# EAGLE design stereo_mixer_quasi_diff_vertical (EAGLE 6.4)
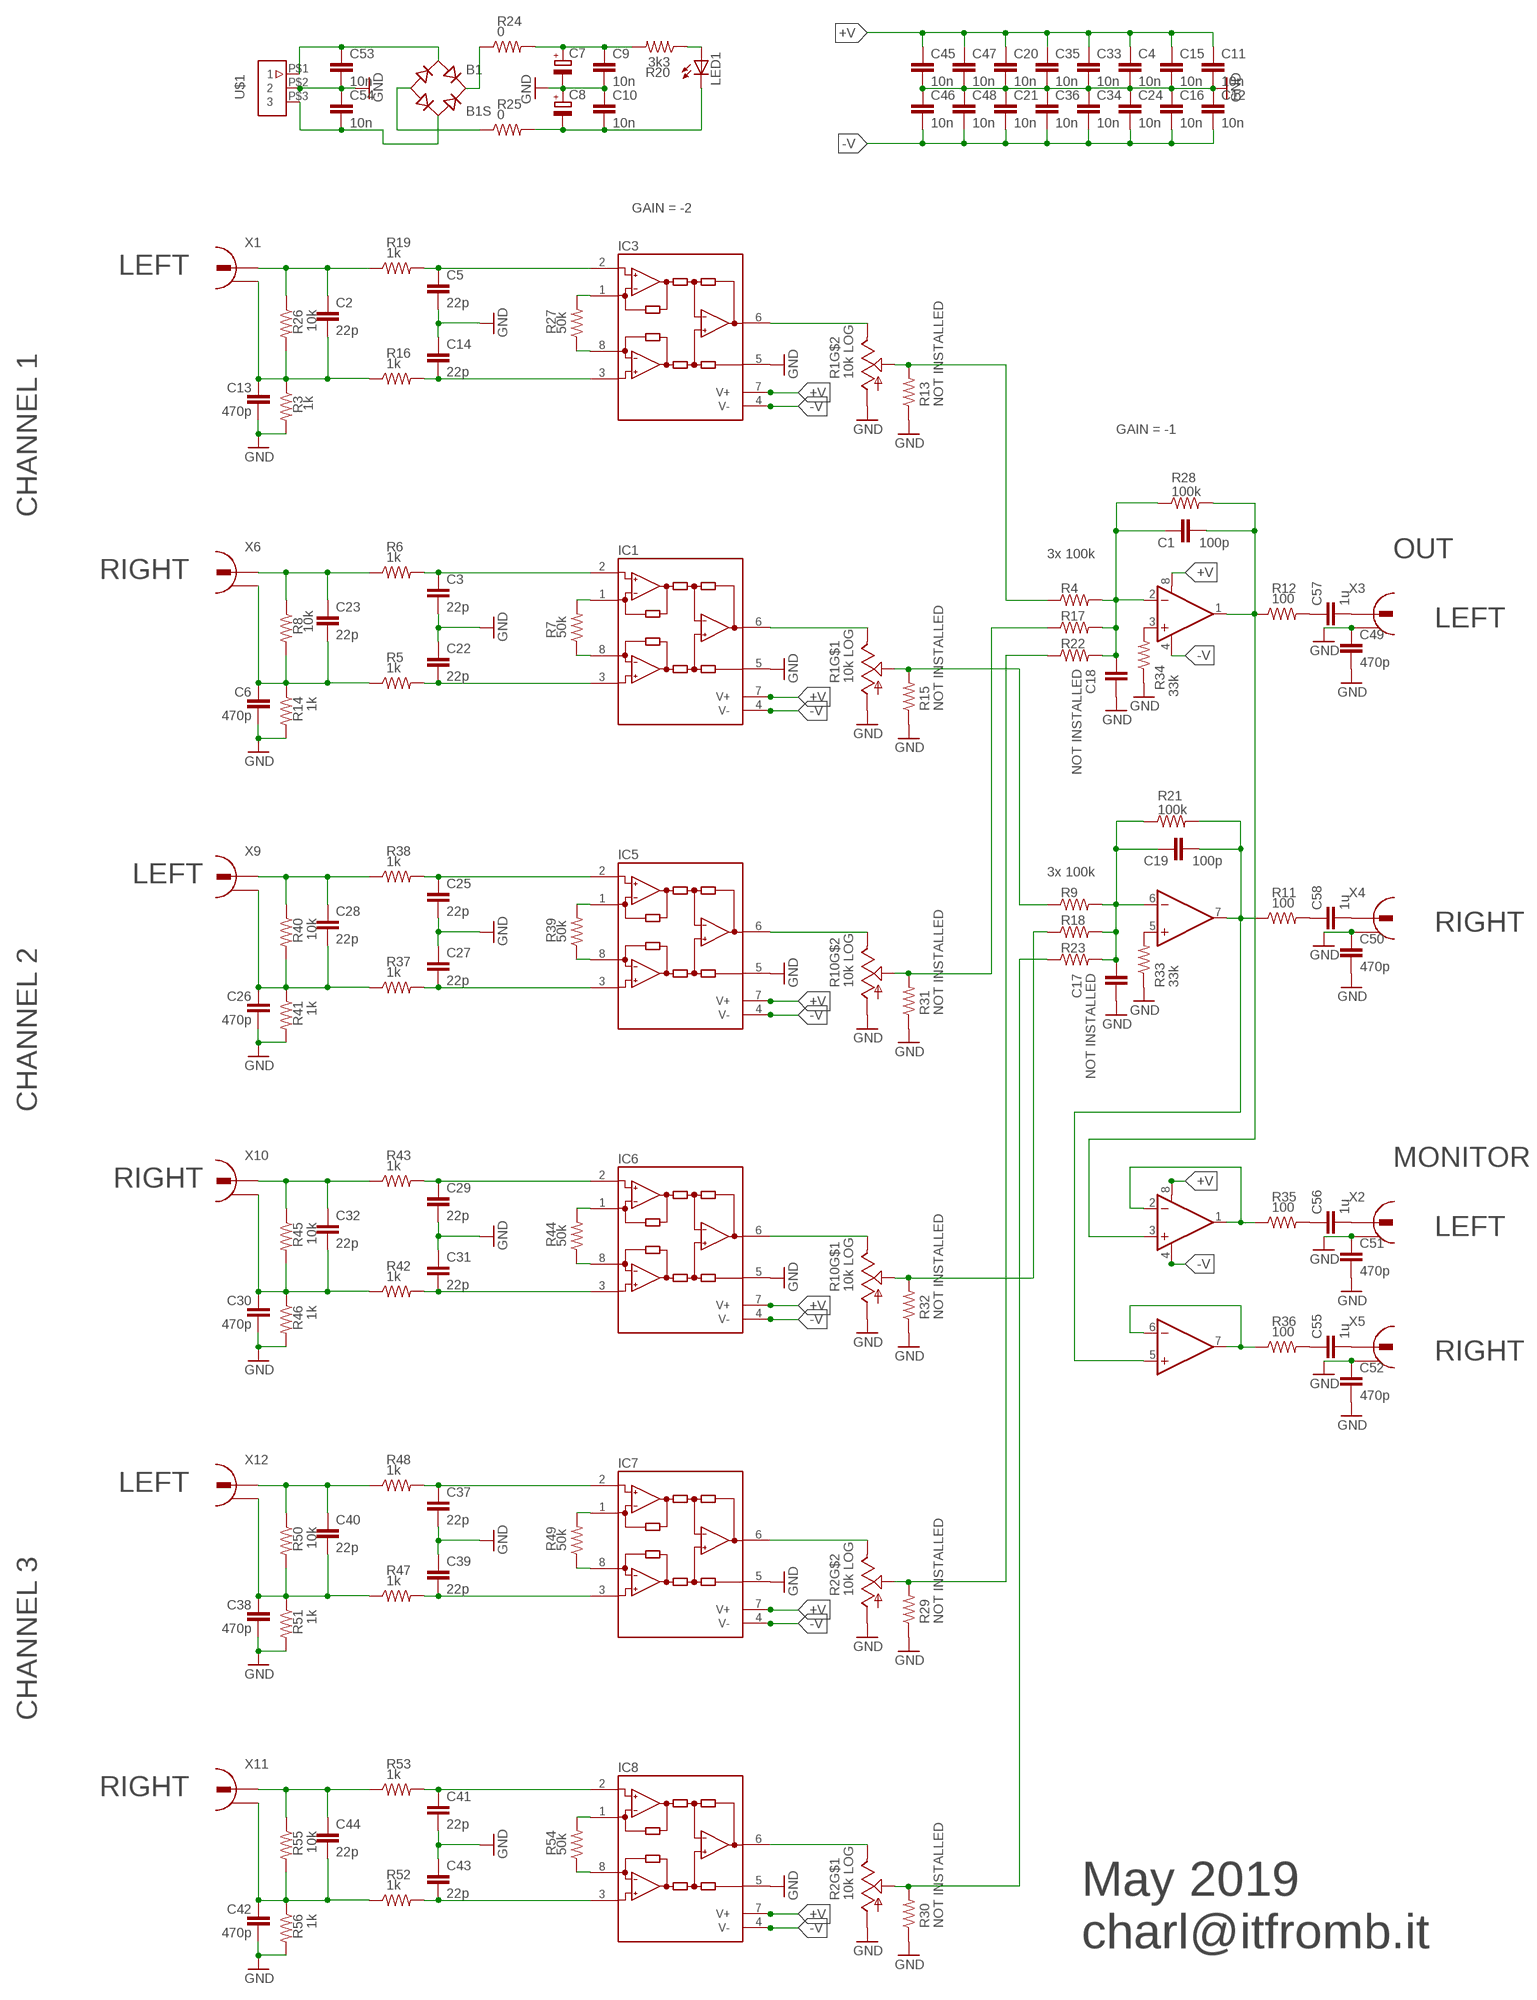
[diagram p0: schematic, sheet 1]

## Parts
B1  B1S  [MBS]
C1  100p  C-EUC1206  [C1206]
C2  22p  C-EUC1206  [C1206]
C3  22p  C-EUC1206  [C1206]
C4  10n  C-EUC1206  [C1206]
C5  22p  C-EUC1206  [C1206]
C6  470p  C-EUC1206  [C1206]
C7  CPOL-EUSANYO_SMD_F12  [SANYO-OSCON_SMD_F12]
C8  CPOL-EUSANYO_SMD_F12  [SANYO-OSCON_SMD_F12]
C9  10n  C-EUC1206  [C1206]
C10  10n  C-EUC1206  [C1206]
C11  10n  C-EUC1206  [C1206]
C12  10n  C-EUC1206  [C1206]
C13  470p  C-EUC1206  [C1206]
C14  22p  C-EUC1206  [C1206]
C15  10n  C-EUC1206  [C1206]
C16  10n  C-EUC1206  [C1206]
C17  NOT INSTALLED  C-EUC1206  [C1206]
C18  NOT INSTALLED  C-EUC1206  [C1206]
C19  100p  C-EUC1206  [C1206]
C20  10n  C-EUC1206  [C1206]
C21  10n  C-EUC1206  [C1206]
C22  22p  C-EUC1206  [C1206]
C23  22p  C-EUC1206  [C1206]
C24  10n  C-EUC1206  [C1206]
C25  22p  C-EUC1206  [C1206]
C26  470p  C-EUC1206  [C1206]
C27  22p  C-EUC1206  [C1206]
C28  22p  C-EUC1206  [C1206]
C29  22p  C-EUC1206  [C1206]
C30  470p  C-EUC1206  [C1206]
C31  22p  C-EUC1206  [C1206]
C32  22p  C-EUC1206  [C1206]
C33  10n  C-EUC1206  [C1206]
C34  10n  C-EUC1206  [C1206]
C35  10n  C-EUC1206  [C1206]
C36  10n  C-EUC1206  [C1206]
C37  22p  C-EUC1206  [C1206]
C38  470p  C-EUC1206  [C1206]
C39  22p  C-EUC1206  [C1206]
C40  22p  C-EUC1206  [C1206]
C41  22p  C-EUC1206  [C1206]
C42  470p  C-EUC1206  [C1206]
C43  22p  C-EUC1206  [C1206]
C44  22p  C-EUC1206  [C1206]
C45  10n  C-EUC1206  [C1206]
C46  10n  C-EUC1206  [C1206]
C47  10n  C-EUC1206  [C1206]
C48  10n  C-EUC1206  [C1206]
C49  470p  C-EUC1206  [C1206]
C50  470p  C-EUC1206  [C1206]
C51  470p  C-EUC1206  [C1206]
C52  470p  C-EUC1206  [C1206]
C53  10n  C-EUC1206  [C1206]
C54  10n  C-EUC1206  [C1206]
C55  1u  C-EUC1206  [C1206]
C56  1u  C-EUC1206  [C1206]
C57  1u  C-EUC1206  [C1206]
C58  1u  C-EUC1206  [C1206]
IC1  INA118U  [SO08]
IC2  OPAMP-DUALU  [SO08]
IC3  INA118U  [SO08]
IC4  OPAMP-DUALU  [SO08]
IC5  INA118U  [SO08]
IC6  INA118U  [SO08]
IC7  INA118U  [SO08]
IC8  INA118U  [SO08]
LED1  LEDCHIPLED_1206  [CHIPLED_1206]
R1  10k LOG  TRIM_US-  [SLIDE_POT_REAR_CONN]
R2  10k LOG  TRIM_US-  [SLIDE_POT_REAR_CONN]
R3  1k  R-US_M1206  [M1206]
R4  100k  R-US_M1206  [M1206]
R5  1k  R-US_M1206  [M1206]
R6  1k  R-US_M1206  [M1206]
R7  50k  R-US_M1206  [M1206]
R8  10k  R-US_M1206  [M1206]
R9  100k  R-US_M1206  [M1206]
R10  10k LOG  TRIM_US-  [SLIDE_POT_REAR_CONN]
R11  100  R-US_M1206  [M1206]
R12  100  R-US_M1206  [M1206]
R13  NOT INSTALLED  R-US_M1206  [M1206]
R14  1k  R-US_M1206  [M1206]
R15  NOT INSTALLED  R-US_M1206  [M1206]
R16  1k  R-US_M1206  [M1206]
R17  100k  R-US_M1206  [M1206]
R18  100k  R-US_M1206  [M1206]
R19  1k  R-US_M1206  [M1206]
R20  3k3  R-US_M1206  [M1206]
R21  100k  R-US_M1206  [M1206]
R22  100k  R-US_M1206  [M1206]
R23  100k  R-US_M1206  [M1206]
R24  0  R-US_M1206  [M1206]
R25  0  R-US_M1206  [M1206]
R26  10k  R-US_M1206  [M1206]
R27  50k  R-US_M1206  [M1206]
R28  100k  R-US_M1206  [M1206]
R29  NOT INSTALLED  R-US_M1206  [M1206]
R30  NOT INSTALLED  R-US_M1206  [M1206]
R31  NOT INSTALLED  R-US_M1206  [M1206]
R32  NOT INSTALLED  R-US_M1206  [M1206]
R33  33k  R-US_M1206  [M1206]
R34  33k  R-US_M1206  [M1206]
R35  100  R-US_M1206  [M1206]
R36  100  R-US_M1206  [M1206]
R37  1k  R-US_M1206  [M1206]
R38  1k  R-US_M1206  [M1206]
R39  50k  R-US_M1206  [M1206]
R40  10k  R-US_M1206  [M1206]
R41  1k  R-US_M1206  [M1206]
R42  1k  R-US_M1206  [M1206]
R43  1k  R-US_M1206  [M1206]
R44  50k  R-US_M1206  [M1206]
R45  10k  R-US_M1206  [M1206]
R46  1k  R-US_M1206  [M1206]
R47  1k  R-US_M1206  [M1206]
R48  1k  R-US_M1206  [M1206]
R49  50k  R-US_M1206  [M1206]
R50  10k  R-US_M1206  [M1206]
R51  1k  R-US_M1206  [M1206]
R52  1k  R-US_M1206  [M1206]
R53  1k  R-US_M1206  [M1206]
R54  50k  R-US_M1206  [M1206]
R55  10k  R-US_M1206  [M1206]
R56  1k  R-US_M1206  [M1206]
U$1  3-PIN-JST-CONN-1.25MM-PITCH  [S3B-PH-VERTICAL]
X1  736880-49RCA-REAR-MOUNT  [RCA-REAR-MOUNT]
X2  736880-49  [RCA-REAR-MOUNT-CENTER-ONLY]
X3  736880-49  [RCA-REAR-MOUNT-CENTER-ONLY]
X4  736880-49  [RCA-REAR-MOUNT-CENTER-ONLY]
X5  736880-49  [RCA-REAR-MOUNT-CENTER-ONLY]
X6  736880-49RCA-REAR-MOUNT  [RCA-REAR-MOUNT]
X9  736880-49RCA-REAR-MOUNT  [RCA-REAR-MOUNT]
X10  736880-49RCA-REAR-MOUNT  [RCA-REAR-MOUNT]
X11  736880-49RCA-REAR-MOUNT  [RCA-REAR-MOUNT]
X12  736880-49RCA-REAR-MOUNT  [RCA-REAR-MOUNT]

## Nets
+V: C4.1 C7.+ C9.1 C11.1 C15.1 C20.1 C33.1 C35.1 C45.1 C47.1 IC1.7(V+) IC2.8(A:V+) IC3.7(V+) IC4.8(A:V+) IC5.7(V+) IC6.7(V+) IC7.7(V+) IC8.7(V+) R20.2 R24.2
-V: C8.- C10.2 C12.2 C16.2 C21.2 C24.2 C34.2 C36.2 C46.2 C48.2 IC1.4(V-) IC2.4(A:V-) IC3.4(V-) IC4.4(A:V-) IC5.4(V-) IC6.4(V-) IC7.4(V-) IC8.4(V-) LED1.C R25.2
GND: C3.2 C4.2 C5.2 C6.2 C7.- C8.+ C9.2 C10.1 C11.2 C12.1 C13.2 C14.1 C15.2 C16.1 C17.1 C18.1 C20.2 C21.1 C22.1 C24.1 C25.2 C26.2 C27.1 C29.2 C30.2 C31.1 C33.2 C34.1 C35.2 C36.1 C37.2 C38.2 C39.1 C41.2 C42.2 C43.1 C45.2 C46.1 C47.2 C48.1 C49.1 C49.2 C50.1 C50.2 C51.1 C51.2 C52.1 C52.2 C53.2 C54.1 IC1.5(REF) IC3.5(REF) IC5.5(REF) IC6.5(REF) IC7.5(REF) IC8.5(REF) R1.R1A(RA) R1.R2A(RA) R2.R1A(RA) R2.R2A(RA) R3.2 R10.R1A(RA) R10.R2A(RA) R13.1 R14.2 R15.1 R29.1 R30.1 R31.1 R32.1 R33.1 R34.1 R41.2 R46.2 R51.2 R56.2 U$1.P$2 X2.SIGNAL X3.SIGNAL X4.SIGNAL X5.SIGNAL
N$2: IC4.1(A:OUT) IC4.2(A:-IN) R35.1
N$3: C2.1 R19.1 R26.1 X1.SIGNAL
N$4: C37.1 IC7.2(-IN) R48.2
N$5: IC3.6(OUT) R1.R2B(RB)
N$6: IC2.5(B:+IN) R33.2
N$7: R1.R2W(RW) R4.1 R13.2
N$8: C38.1 C40.2 R47.1 R50.2 R51.1 X12.RING
N$10: R1.R1W(RW) R9.1 R15.2
N$11: C19.2 IC2.7(B:OUT) IC4.5(B:+IN) R11.1 R21.2
N$12: IC3.1(RG) R27.2
N$13: C3.1 IC1.2(-IN) R6.2
N$14: C25.1 IC5.2(-IN) R38.2
N$16: C6.1 C23.2 R5.1 R8.2 R14.1 X6.RING
N$17: C14.2 IC3.3(+IN) R16.2
N$18: C5.1 IC3.2(-IN) R19.2
N$19: C2.2 C13.1 R3.1 R16.1 R26.2 X1.RING
N$20: IC2.3(A:+IN) R34.2
N$21: C1.1 C18.2 IC2.2(A:-IN) R4.2 R17.2 R22.2 R28.1
N$23: C17.2 C19.1 IC2.6(B:-IN) R9.2 R18.2 R21.1 R23.2
N$24: C23.1 R6.1 R8.1 X6.SIGNAL
N$25: IC1.8(RG) R7.1
N$26: IC3.8(RG) R27.1
N$27: C22.2 IC1.3(+IN) R5.2
N$28: IC1.6(OUT) R1.R1B(RB)
N$29: R2.R2W(RW) R22.1 R29.2
N$30: R2.R1W(RW) R23.1 R30.2
N$31: IC1.1(RG) R7.2
N$32: B1.AC1 C53.1 U$1.P$1
N$33: B1.+ R24.1
N$34: B1.AC2 C54.2 U$1.P$3
N$35: B1.- R25.1
N$36: IC4.6(B:-IN) IC4.7(B:OUT) R36.1
N$38: LED1.A R20.1
N$39: C40.1 R48.1 R50.1 X12.SIGNAL
N$40: C1.2 IC2.1(A:OUT) IC4.3(A:+IN) R12.1 R28.2
N$41: C26.1 C28.2 R37.1 R40.2 R41.1 X9.RING
N$42: C28.1 R38.1 R40.1 X9.SIGNAL
N$43: IC5.8(RG) R39.1
N$44: C27.2 IC5.3(+IN) R37.2
N$45: IC6.6(OUT) R10.R1B(RB)
N$46: IC5.1(RG) R39.2
N$47: C29.1 IC6.2(-IN) R43.2
N$48: C30.1 C32.2 R42.1 R45.2 R46.1 X10.RING
N$49: C32.1 R43.1 R45.1 X10.SIGNAL
N$50: IC6.8(RG) R44.1
N$51: C31.2 IC6.3(+IN) R42.2
N$52: IC5.6(OUT) R10.R2B(RB)
N$53: IC6.1(RG) R44.2
N$54: R10.R2W(RW) R17.1 R31.2
N$55: R10.R1W(RW) R18.1 R32.2
N$57: IC7.8(RG) R49.1
N$58: C39.2 IC7.3(+IN) R47.2
N$59: IC7.1(RG) R49.2
N$60: C41.1 IC8.2(-IN) R53.2
N$61: C42.1 C44.2 R52.1 R55.2 R56.1 X11.RING
N$62: C44.1 R53.1 R55.1 X11.SIGNAL
N$63: IC8.8(RG) R54.1
N$64: C43.2 IC8.3(+IN) R52.2
N$65: IC8.1(RG) R54.2
N$66: IC8.6(OUT) R2.R1B(RB)
N$67: IC7.6(OUT) R2.R2B(RB)
N$69: C55.1 R36.2
N$70: C56.1 R35.2
N$71: C57.1 R12.2
N$72: C58.1 R11.2
N$73: C57.2 X3.RING
N$74: C58.2 X4.RING
N$75: C56.2 X2.RING
N$76: C55.2 X5.RING

## Notes on the sheet
- GAIN = -2
- LEFT
- GAIN = -1
- CHANNEL 1
- RIGHT | 3x 100k | OUT
- LEFT
- LEFT
- 3x 100k
- RIGHT
- CHANNEL 2
- RIGHT | MONITOR
- LEFT
- RIGHT
- LEFT
- CHANNEL 3
- RIGHT
- May 2019
  charl@itfromb.it

## Library data of the parts
B1 = rectifier:B*S: Surface Mount Glass Passivated Bridge Rectifiers Source: Comchip Bridge Rectifiers B05S-G_B10S-G.pdf
C1-C6 C9-C58 = rcl:C-EU: CAPACITOR, European symbol
C7 C8 = stereo_5.1_mixer:CPOL-EU: POLARIZED CAPACITOR, European symbol
IC1 IC3 IC5-IC8 = stereo_5.1_mixer:INA118: Instrumentation Amplifier Precision, Low Power; MF: TEXAS INSTRUMENTS; MPN: INA118U; OC_FARNELL: 1212404; OC_NEWARK: 04M6168
IC2 IC4 = SparkFun:OPAMP-DUAL: Operational Amplifier
LED1 = led:LED: LED OSRAM: - CHIPLED LG R971, LG N971, LY N971, LG Q971, LY Q971, LO R971, LY R971 LH N974, LH R974 LS Q976, LO Q976, LY Q976 LO Q996 - Hyper CHIPLED LW Q18S LB Q993, LB Q99A, LB R99A - SideLED LS A670, LO A670, LY A670, LG A670, LP A670 LB A673, LV A673, LT A673, LW A673 LH A674 LY A675 LS A676, LA A676, LO A676, LY A676, LW A676 LS A679, LY A679, LG A679 - Hyper Micro SIDELED® LS Y876, LA Y876, LO Y876, LY Y876 LT Y87S - SmartLED LW L88C, LW L88S LB L89C, LB L89S, LG L890 LS L89K, LO L89K, LY L89K LS L896, LA L896, LO L896, LY L896 - TOPLED LS T670, LO T670, LY T670, LG T670, LP T670 LSG T670, LSP T670, LSY T670, LOP T670, LYG T670 LG T671, LOG T671, LSG T671 LB T673, LV T673, LT T673, LW T673 LH T674 LS T676, LA T676, LO T676, LY T676, LB T676, LH T676, LSB T676, LW T676 LB T67C, LV T67C, LT T67C, LS T67K, LO T67K, LY T67K, LW E67C LS E67B, LA E67B, LO E67B, LY E67B, LB E67C, LV E67C, LT E67C LW T67C LS T679, LY T679, LG T679 LS T770, LO T770, LY T770, LG T770, LP T770 LB T773, LV T773, LT T773, LW T773 LH T774 LS E675, LA E675, LY E675, LS T675 LS T776, LA T776, LO T776, LY T776, LB T776 LHGB T686 LT T68C, LB T68C - Hyper Mini TOPLED® LB M676 - Mini TOPLED Santana® LG M470 LS M47K, LO M47K, LY M47K Source: http://www.osram.convergy.de LUXEON: - LUMILED® LXK2-PW12-R00, LXK2-PW12-S00, LXK2-PW14-U00, LXK2-PW14-V00 LXK2-PM12-R00, LXK2-PM12-S00, LXK2-PM14-U00 LXK2-PE12-Q00, LXK2-PE12-R00, LXK2-PE12-S00, LXK2-PE14-T00, LXK2-PE14-U00 LXK2-PB12-K00, LXK2-PB12-L00, LXK2-PB12-M00, LXK2-PB14-N00, LXK2-PB14-P00, LXK2-PB14-Q00 LXK2-PR12-L00, LXK2-PR12-M00, LXK2-PR14-Q00, LXK2-PR14-R00 LXK2-PD12-Q00, LXK2-PD12-R00, LXK2-PD12-S00 LXK2-PH12-R00, LXK2-PH12-S00 LXK2-PL12-P00, LXK2-PL12-Q00, LXK2-PL12-R00 Source: www.luxeon.com KINGBRIGHT: KA-3528ASYC Source: www.kingbright.com
R1 R2 R10 = stereo_5.1_mixer:TRIM_US-: POTENTIOMETER
R3-R9 R11-R56 = rcl:R-US_: RESISTOR, American symbol
U$1 = stereo_5.1_mixer:3-PIN-JST-CONN-1.25MM-PITCH
X1-X6 X9-X12 = stereo_5.1_mixer:736880-49: Cinch Connector ( RCA Jack )

## Board
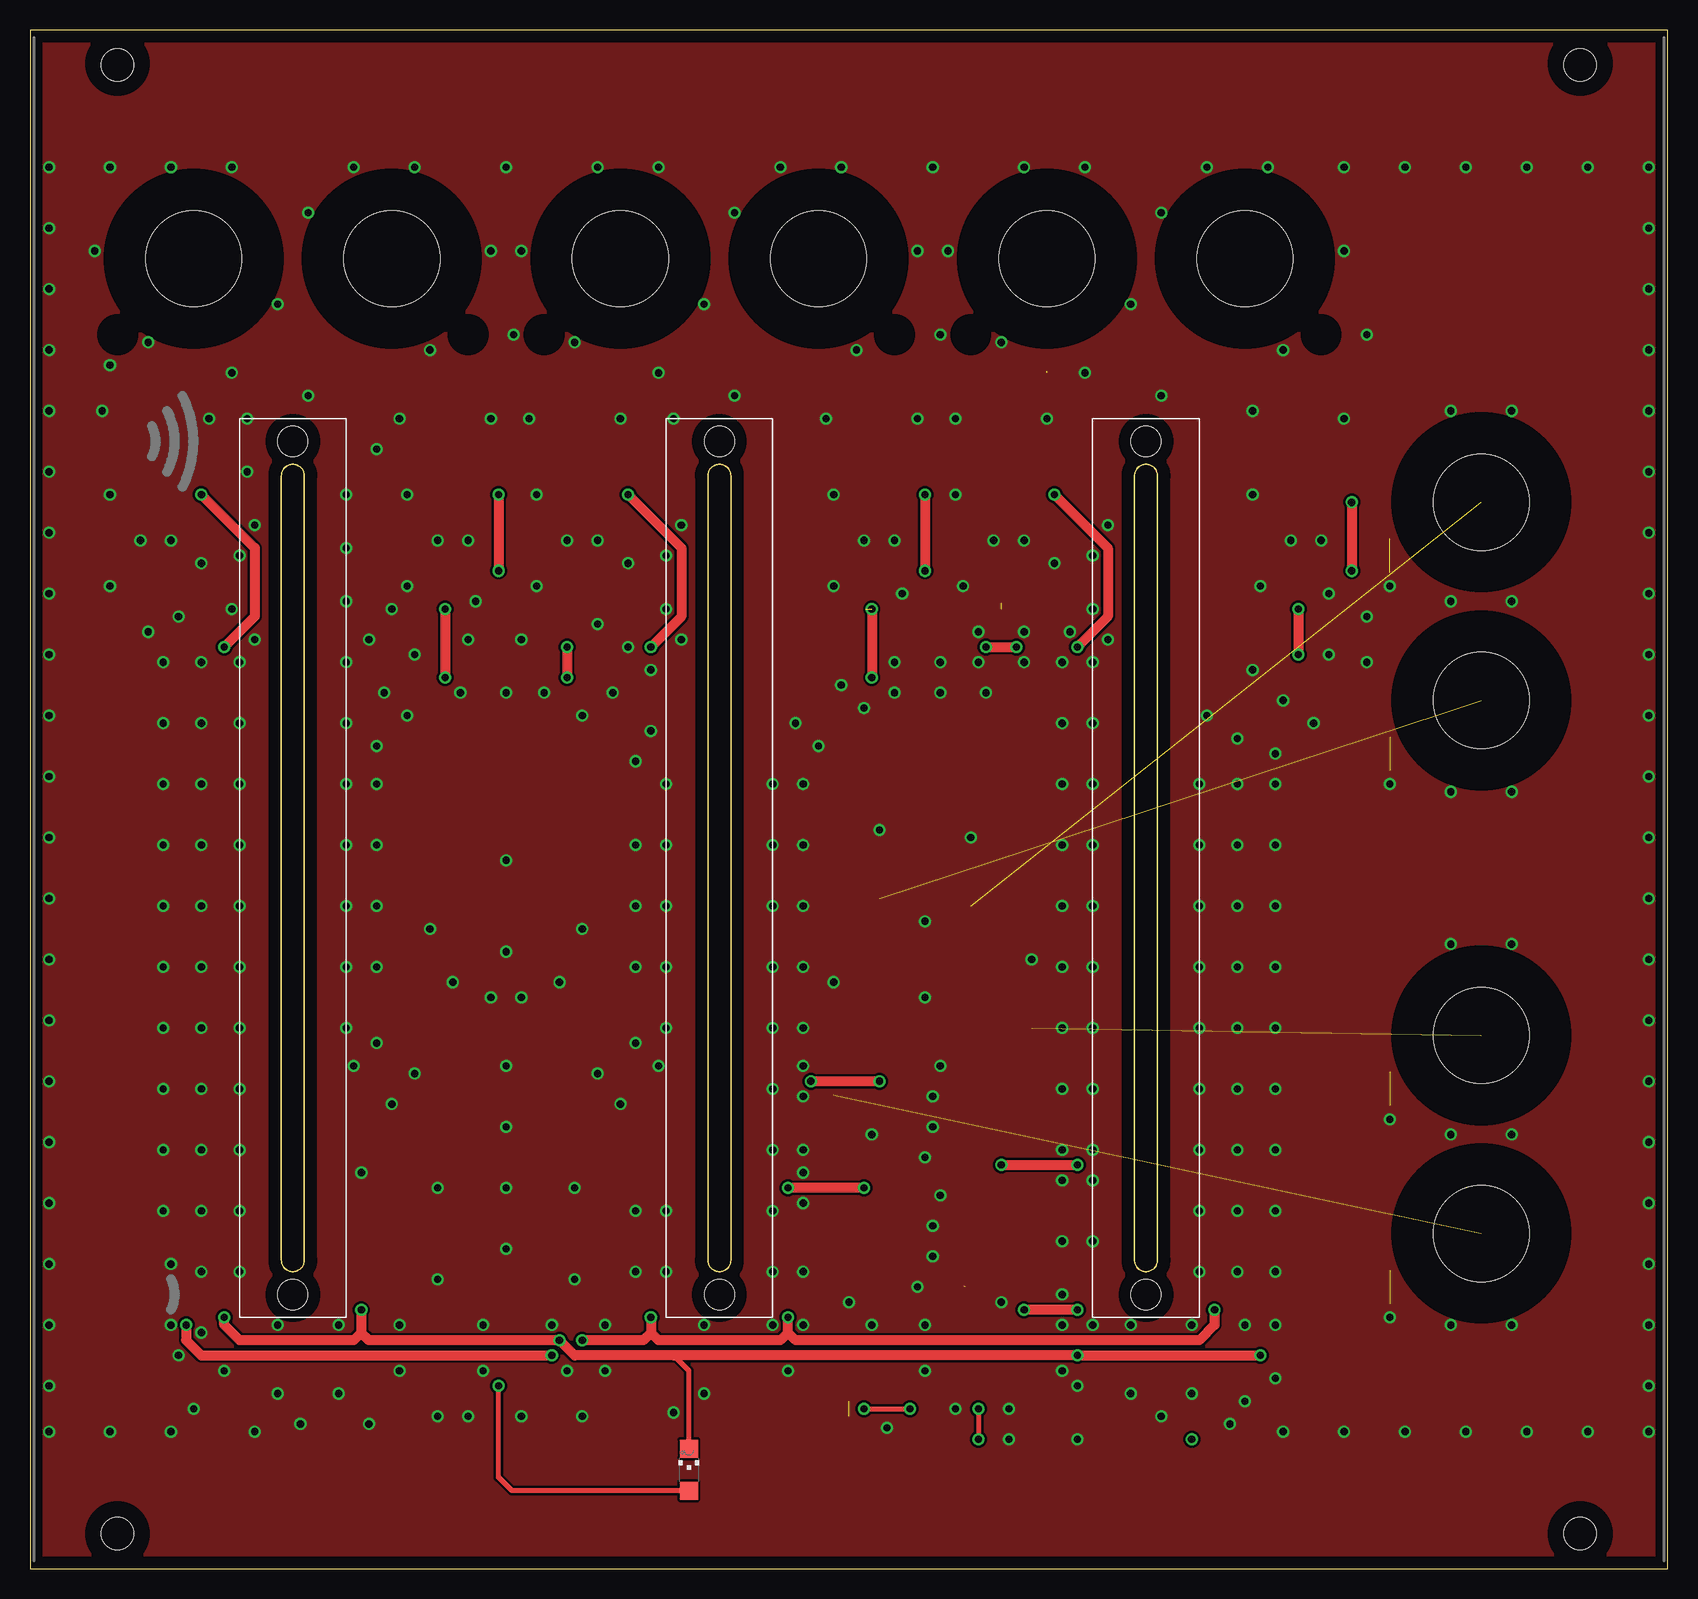
[diagram p1: board, top side]
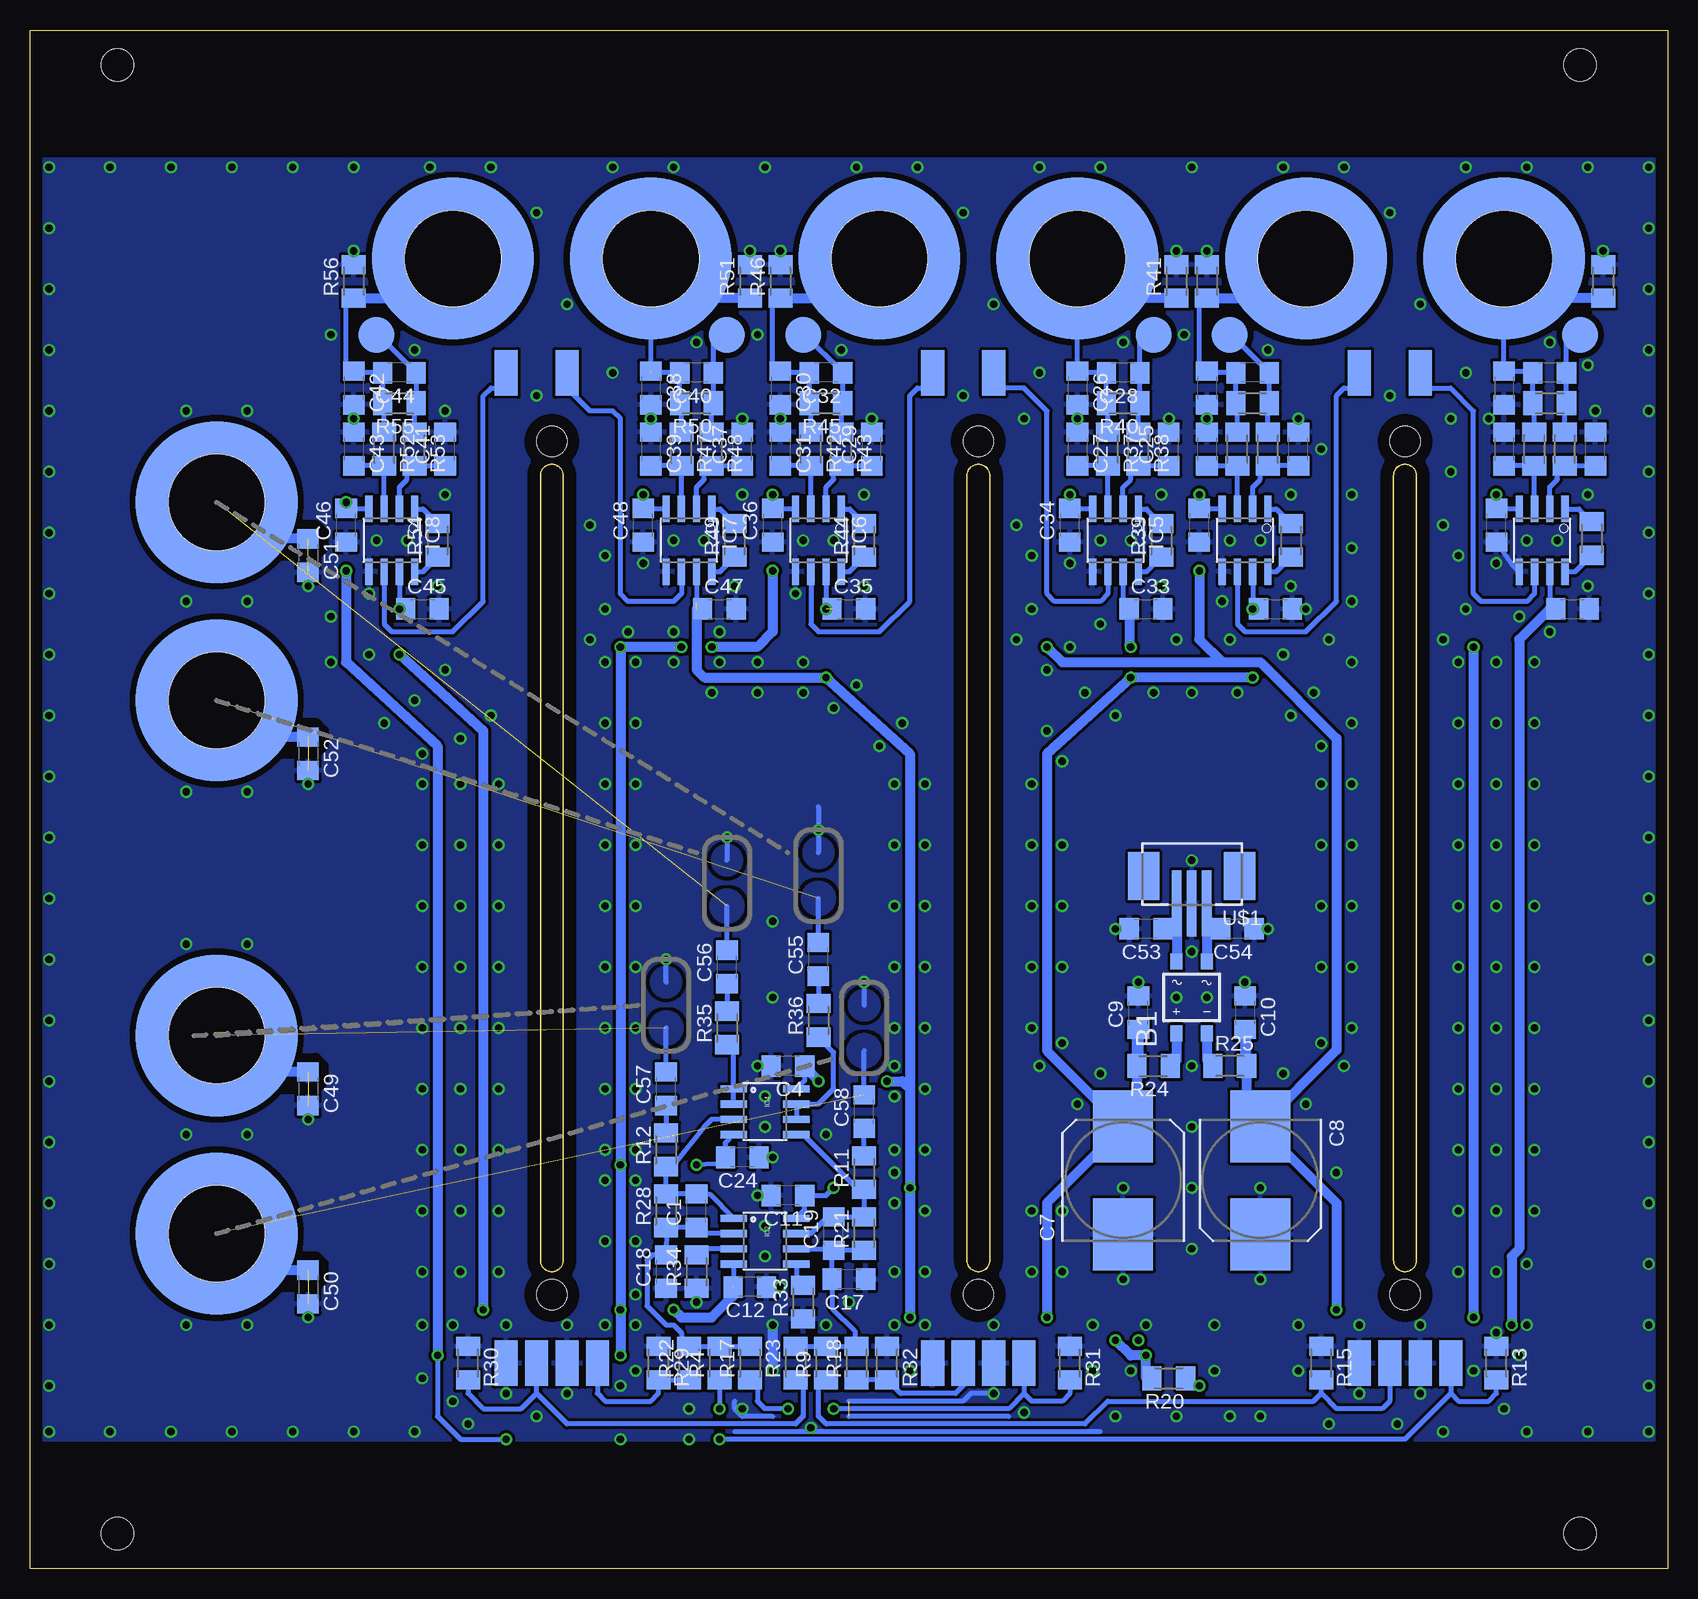
[diagram p2: board, bottom side, seen from below]

Size 136.53 x 128.27 mm. Coordinates in mm from the lower left corner, seen from the top.
Outline: 0,0 136.53,0 136.53,128.27 0,128.27 0,0
Copper layers (1*16): Top 0.035mm / dielectric 1.5mm / Bottom 0.035mm
Design rules "default": minimum track width 10mil, minimum drill 24mil, track to track 8mil, track to pad 8mil, pad to pad 8mil, via to via 8mil, smd to smd 8mil, copper to edge 40mil, drill to drill 8mil, minimum pad ring 10mil, minimum via ring 8mil, stop-mask expansion 4mil, vias tented up to drill 0mil, thermal gap 10mil
Holes 2.7 mm at 129.22,125.35 7.3,125.35 7.3,2.92 129.22,2.92
bKeepout: area 65.7,41.9 to 68.3,44.5; area 65.7,45.7 to 68.3,48.3; area 82.2,43.8 to 84.8,46.4; area 82.2,47.6 to 84.8,50.2; area 77.2,54 to 79.7,56.5; area 77.2,57.8 to 79.7,60.3; area 69.5,58.4 to 72.1,61; area 69.5,54.6 to 72.1,57.2
tRestrict: area 5,0.6 to 9.6,5.2; area 126.9,0.6 to 131.5,5.2; area 126.9,123.2 to 131.5,127.8; area 5,123.2 to 9.6,127.8
bRestrict: area 69.4,58.3 to 72.2,61.1; area 65.6,45.6 to 68.4,48.4; area 82.1,47.5 to 84.9,50.3; area 77,57.7 to 79.8,60.5; 20 lines

### Footprints (pad centres in the part's own frame; a part is rotated, then mirrored left to right if it is on the bottom)
MBS = smd 1 x 1.3: + -1.27,-3; - 1.27,-3; AC1 -1.27,3; AC2 1.27,3
C1206 = smd 1.6 x 1.8: 1 -1.4,0; 2 1.4,0
SANYO-OSCON_SMD_F12 = smd 6 x 5: + 4.5,0; - -4.5,0
SO08 = smd 0.61 x 2.21: 1 -1.905,-2.616; 2 -0.635,-2.616; 3 0.635,-2.616; 4 1.905,-2.616; 5 1.905,2.616; 6 0.635,2.616; 7 -0.635,2.616; 8 -1.905,2.616
CHIPLED_1206 = smd 1.5 x 1.5: A 0,-1.75; C 0,1.75
SLIDE_POT_REAR_CONN = smd 1.93 x 3.81 bottom: R1A -10.16,83.185; R1B -10.16,0.635; R1W -7.62,83.185; R2A -5.08,83.185; R2B -5.08,0.635; R2W -2.54,83.185 | hole 2.5: -6.35,6.35; -6.35,77.47
M1206 = smd 1.6 x 2: 1 -1.4,0; 2 1.4,0
S3B-PH-VERTICAL = smd 0.8 x 5.5: P$1 -1.25,-2; P$2 0,-2; P$3 1.25,-2 | smd 2.6 x 4: P$4 -4,0.27; P$5 4,0.27
RCA-REAR-MOUNT = smd 13.5 x 13.5 bottom: RING 0,0 | smd 3 x 3 bottom: SIGNAL 6.35,6.35 | hole 8: 0,0
RCA-REAR-MOUNT-CENTER-ONLY = smd 13.5 x 13.5 bottom: RING 0,0 | smd 3.226 x 3.226 bottom: SIGNAL 0,0 | hole 8: 0,0

### Placement (x,y rotation side)
B1  39.69,47.62 0 bottom
C1  80.96,29.85 90 bottom
C2  9.84,99.7 180 bottom
C3  30.8,93.34 90 bottom
C4  73.34,41.91 180 bottom
C5  6.03,93.34 90 bottom
C6  38.42,98.43 270 bottom
C7  45.4,32.39 90 bottom
C8  33.97,32.39 270 bottom
C9  44.13,46.36 90 bottom
C10  35.24,46.36 270 bottom
C11  73.34,31.12 180 bottom
C12  76.52,23.5 180 bottom
C13  13.65,98.43 270 bottom
C14  13.65,93.34 270 bottom
C15  7.94,80.01 0 bottom
C16  14.29,87 90 bottom
C17  68.26,24.13 180 bottom
C18  83.5,24.77 90 bottom
C19  69.53,27.94 90 bottom
C20  32.7,80.01 0 bottom
C21  39.05,87 90 bottom
C22  38.42,93.34 270 bottom
C23  34.61,99.7 180 bottom
C24  77.15,34.29 180 bottom
C25  41.59,93.34 90 bottom
C26  49.21,98.43 270 bottom
C27  49.21,93.34 270 bottom
C28  45.4,99.7 180 bottom
C29  66.36,93.34 90 bottom
C30  73.98,98.43 270 bottom
C31  73.98,93.34 270 bottom
C32  70.17,99.7 180 bottom
C33  43.5,80.01 0 bottom
C34  49.85,87 90 bottom
C35  68.26,80.01 0 bottom
C36  74.61,87 90 bottom
C37  77.15,93.34 90 bottom
C38  84.77,98.43 270 bottom
C39  84.77,93.34 270 bottom
C40  80.96,99.7 180 bottom
C41  101.92,93.34 90 bottom
C42  109.54,98.43 270 bottom
C43  109.54,93.34 270 bottom
C44  105.73,99.7 180 bottom
C45  103.82,80.01 0 bottom
C46  110.17,87 90 bottom
C47  79.06,80.01 0 bottom
C48  85.41,87 90 bottom
C49  113.35,40.01 270 bottom
C50  113.35,23.5 270 bottom
C51  113.35,84.46 270 bottom
C52  113.35,67.95 270 bottom
C53  43.5,53.34 180 bottom
C54  35.88,53.34 180 bottom
C55  70.8,50.8 90 bottom
C56  78.42,50.17 90 bottom
C57  83.5,40.01 90 bottom
C58  66.99,38.1 90 bottom
IC1  35.24,85.73 180 bottom
IC2  75.25,27.31 270 bottom
IC3  10.48,85.73 180 bottom
IC4  75.25,38.1 270 bottom
IC5  46.04,85.73 180 bottom
IC6  70.8,85.73 180 bottom
IC7  81.6,85.73 180 bottom
IC8  106.36,85.73 180 bottom
LED1  54.93,8.26 0 top
R1  15.56,100.33 180 top
R2  86.68,100.33 180 top
R3  5.4,107.31 90 bottom
R4  79.06,17.15 90 bottom
R5  35.88,93.34 270 bottom
R6  33.34,93.34 270 bottom
R7  31.43,85.73 90 bottom
R8  34.61,97.16 180 bottom
R9  70.17,17.15 90 bottom
R10  51.12,100.33 180 top
R11  66.99,33.02 90 bottom
R12  83.5,34.93 90 bottom
R13  14.29,17.15 270 bottom
R14  38.42,107.31 90 bottom
R15  28.89,17.15 270 bottom
R16  11.11,93.34 270 bottom
R17  76.52,17.15 90 bottom
R18  67.63,17.15 90 bottom
R19  8.57,93.34 270 bottom
R20  41.59,15.88 180 bottom
R21  66.99,27.94 90 bottom
R22  81.6,17.15 90 bottom
R23  72.71,17.15 90 bottom
R24  42.86,41.91 180 bottom
R25  36.51,41.91 0 bottom
R26  9.84,97.16 180 bottom
R27  6.35,85.88 90 bottom
R28  83.5,29.85 90 bottom
R29  84.14,17.15 270 bottom
R30  100.01,17.15 270 bottom
R31  49.85,17.15 270 bottom
R32  65.09,17.15 270 bottom
R33  72.07,22.23 90 bottom
R34  80.96,24.77 90 bottom
R35  78.42,45.09 90 bottom
R36  70.8,45.72 90 bottom
R37  46.67,93.34 270 bottom
R38  44.13,93.34 270 bottom
R39  42.23,85.73 90 bottom
R40  45.4,97.16 180 bottom
R41  40.96,107.31 90 bottom
R42  71.44,93.34 270 bottom
R43  68.9,93.34 270 bottom
R44  66.99,85.73 90 bottom
R45  70.17,97.16 180 bottom
R46  73.98,107.31 90 bottom
R47  82.23,93.34 270 bottom
R48  79.69,93.34 270 bottom
R49  77.79,85.73 90 bottom
R50  80.96,97.16 180 bottom
R51  76.52,107.31 90 bottom
R52  107,93.34 270 bottom
R53  104.46,93.34 270 bottom
R54  102.55,85.73 90 bottom
R55  105.73,97.16 180 bottom
R56  109.54,107.31 90 bottom
U$1  39.69,57.47 0 bottom
X1  13.65,109.22 180 top
X2  120.97,88.9 180 top
X3  120.97,44.45 90 top
X4  120.97,27.94 90 top
X5  120.97,72.39 180 top
X6  30.16,109.22 270 top
X9  49.21,109.22 180 top
X10  65.72,109.22 270 top
X11  101.28,109.22 270 top
X12  84.77,109.22 180 top

### Tracks (layer width: path | path; a pad name or v marks a point on that pad's centre or on a via)
+V  (via drill 0.6)  (2 unrouted)
  Top 0.813: v34.61,80.01 v34.61,74.3 | 63.18,19.69 62.55,19.05 52.39,19.05 51.75,19.69 | 51.75,19.69 51.12,19.05 v46.04,19.05 | v98.74,21.59 98.74,20.32 97.47,19.05 63.82,19.05 63.18,19.69 | v43.5,17.78 14.29,17.78 13.02,19.05 v13.02,20.32 | v70.17,80.01 v70.17,74.3 | v69.53,31.75 v63.18,31.75 | v70.8,40.64 v65.09,40.64 | v105.73,80.01 v105.73,76.2 | 63.18,19.69 v63.18,20.96 | v51.75,20.96 51.75,19.69 | v44.77,76.84 v44.77,74.3
  Bottom 0.406: IC1.7 v34.61,80.01 | IC3.7 9.84,80.01 9.84,79.51 C15.1 | IC5.7 45.4,80.52 C33.1 | IC6.7 v70.17,80.01 | IC2.8 71.94,29.9 C11.1 70.17,31.12 v69.53,31.75 | C4.1 71.94,40.69 IC4.8 | IC7.7 80.96,80.52 C47.1 | IC8.7 105.73,80.52 C45.1
  Bottom 0.813: C20.1 v34.61,80.01 | 9.84,80.01 12.38,77.47 12.38,26.67 13.02,26.04 v13.02,20.32 | 45.36,36.78 C7.+ 44.26,38.03 R24.2 | C9.1 44.13,42.04 R24.2 | R24.2 44.26,44.96 44.13,45.09 | v70.8,40.64 C4.1 | v65.09,40.64 63.82,40.64 63.18,40.01 | C45.1 v105.73,80.01 | v105.73,76.2 98.74,69.85 v98.74,21.59 | 63.18,40.01 63.18,67.95 v70.17,74.3 80.33,74.3 80.96,74.93 80.96,80.01 | 63.18,40.01 v63.18,31.75 v63.18,20.96 | v46.04,19.05 44.77,17.78 v43.5,17.78 43.5,15.88 R20.2 | v34.61,74.3 v44.77,74.3 51.75,67.95 51.75,43.17 45.36,36.78 | 45.36,36.78 45.36,36.87 51.75,30.48 v51.75,20.96 | C33.1 44.9,76.97 v44.77,76.84
-V  (via drill 0.6)  (1 unrouted)
  Top 0.406: LED1.C 54.93,16.51 53.66,17.78
  Top 0.813: v39.05,89.53 v39.05,83.19 | v102.55,17.78 v87.31,17.78 53.66,17.78 45.4,17.78 v44.13,19.05 28.26,19.05 27.62,19.69 | v16.19,20.96 16.19,20.32 17.46,19.05 26.99,19.05 27.62,19.69 | v14.29,89.53 18.73,85.09 18.73,79.38 v16.19,76.84 | v49.85,89.53 54.29,85.09 54.29,79.38 v51.75,76.84 | v74.61,89.53 v74.61,83.19 | v85.41,89.53 89.85,85.09 89.85,79.38 v87.31,76.84 | v110.17,88.9 v110.17,83.19 | v80.96,33.66 v87.31,33.66 | v79.69,76.84 v82.23,76.84 | v87.31,21.59 v82.87,21.59 | v27.62,21.59 27.62,19.69
  Bottom 0.406: IC1.4 39,88.34 C21.2 | IC3.4 14.23,88.34 C16.2 | IC5.4 49.79,88.34 C34.2 v49.85,89.53 | C36.2 74.56,88.34 IC6.4 74.05,88.34 74.61,88.9 v74.61,89.53 | IC2.4 77.86,23.55 | IC4.4 78.55,35.51 C24.2 78.55,33.79 v80.96,33.66 | v102.55,17.78 102.55,12.7 100.65,10.8 v96.84,10.8 | C48.2 83.56,88.4 IC7.4 | C46.2 108.32,88.4 IC8.4
  Bottom 0.813: v87.31,17.78 v87.31,21.59 v87.31,33.66 v87.31,76.84 v82.23,76.84 | v16.19,76.84 v16.19,20.96 | C16.2 v14.29,89.53 | v39.05,89.53 39.18,88.27 C21.2 | v51.75,76.84 50.48,75.56 37.15,75.56 | 37.15,75.56 33.97,75.56 27.62,69.22 27.62,43.24 C8.- | v74.61,83.19 74.61,78.11 75.88,76.84 v79.69,76.84 | C10.2 35.24,42.04 R25.2 | R25.2 35.11,44.96 35.24,45.09 | C48.2 v85.41,89.53 | C46.2 v110.17,88.9 | v110.17,83.19 110.17,75.56 102.55,68.58 v102.55,17.78 | v82.87,21.59 82.23,20.96 79.69,20.96 77.92,22.73 C12.2 | v39.05,83.19 39.05,77.47 37.15,75.56 | C8.- 33.97,36.83 27.62,30.48 v27.62,21.59 | R25.2 35.11,38.61 33.34,36.83 33.92,36.83 C8.-
GND  (via drill 0.6)  (5 unrouted)
  Bottom 0.406: IC3.5 12.96,83.69 C16.1 | 70.8,63.5 70.8,59.69 | v66.99,48.9 66.99,46.99 | 83.5,48.9 v83.5,50.8 | v78.42,60.96 78.42,59.06 | 47.31,11.43 71.44,11.43 | 71.44,11.43 v71.44,11.75 | 54.93,12.7 68.26,12.7 | v56.2,14.61 58.1,14.61 58.74,13.97 68.26,13.97 | 71.44,11.43 77.79,11.43 | 74.61,12.7 77.15,12.7 | 77.15,12.7 77.79,13.34 77.79,13.97 | 77.15,12.7 v77.15,13.34
  Bottom 0.813: C49.1 117.29,41.41 X3.SIGNAL 119.83,45.59 | 119.83,29.08 X4.SIGNAL 117.29,24.9 C50.1 | C51.1 117.92,85.86 X2.SIGNAL | C52.1 117.29,69.34 X5.SIGNAL | v74.61,20.32 v74.61,16.51
  other vias: 14.29,83.82 64.45,20.32 63.18,16.51 61.91,20.32 38.42,109.86 16.83,80.01 12.38,79.38 9.84,78.11 17.46,84.46 18.73,87 18.1,91.44 18.1,95.89 14.92,95.89 6.03,96.52 5.4,109.86 16.83,99.7 31.43,81.92 30.16,80.01 33.97,85.73 36.51,85.73 37.15,80.65 36.51,77.47 32.07,76.2 28.26,77.47 26.35,80.65 26.35,85.09 26.35,89.53 31.43,89.53 28.89,93.34 11.75,85.73 9.21,85.73 6.67,81.92 42.23,81.92 40.96,77.47 47.31,78.74 49.85,83.82 44.77,85.73 47.31,85.73 40.96,109.86 52.39,99.7 9.84,102.24 23.18,97.79 33.34,101.6 68.9,101.6 30.8,95.89 38.42,95.89 41.59,95.89 40.32,102.87 49.21,95.89 45.4,102.24 80.96,102.24 53.66,95.89 58.74,97.79 66.36,95.89 73.98,95.89 66.99,89.53 81.6,13.34 81.6,10.8 80.96,22.23 73.98,23.5 75.25,26.04 75.25,28.58 69.53,85.73 72.07,85.73 66.99,81.92 76.52,109.86 87.95,99.7 73.98,109.86 75.88,102.87 77.79,81.92 74.61,34.29 75.88,41.91 75.88,31.12 70.17,36.2 80.33,85.73 82.87,85.73 105.09,85.73 107.63,85.73 70.8,61.6 111.44,102.87 113.35,81.92 109.54,95.89 101.92,96.52 84.77,95.89 77.15,95.89 77.15,89.53 101.92,89.53 42.23,89.53 6.67,89.53 102.55,81.92 85.41,83.82 113.35,65.41 113.35,37.47 113.35,20.96 53.02,84.46 53.02,80.01 54.29,87 54.29,77.47 89.85,77.47 89.85,87 88.58,84.46 88.58,80.01 18.73,77.47 86.04,22.86 91.76,20.32 86.04,16.51 88.58,20.32 91.76,14.61 96.84,20.32 94.3,12.7 101.28,20.32 101.28,13.97 56.2,20.32 20.64,20.32 20.64,14.61 25.72,20.32 47.94,20.32 47.94,16.51 37.78,16.51 37.78,20.32 30.8,16.51 30.8,20.32 43.5,20.32 44.77,16.51 46.04,12.7 36.51,12.7 33.97,12.7 22.54,12.07 18.73,11.43 53.66,13.02 75.25,36.83 75.25,39.37 86.04,20.32 87.31,15.24 87.31,10.8 100.01,12.07 103.82,15.88 103.82,20.32 96.84,14.61 86.04,27.31 86.04,32.39 86.04,34.93 35.88,73.03 42.86,73.03 29.53,73.03 31.43,71.12 28.89,68.58 26.35,75.56 26.35,70.48 64.45,33.02 64.45,30.48 64.45,39.37 64.45,41.91 56.2,105.41 58.74,113.03 91.76,105.41 94.3,113.03 23.18,113.03 20.64,105.41 94.3,97.79 118.43,80.65 123.51,80.65 118.43,36.2 123.51,36.2 25.72,14.61 14.29,75.56 14.29,70.48 14.29,65.41 14.29,60.33 17.46,65.41 17.46,60.33 17.46,70.48 17.46,75.56 11.11,75.56 11.11,70.48 11.11,65.41 11.11,60.33 14.29,55.25 14.29,50.17 17.46,55.25 17.46,50.17 11.11,50.17 11.11,55.25 14.29,45.09 14.29,40.01 14.29,34.93 14.29,29.85 14.29,24.77 14.29,19.69 17.46,24.77 17.46,29.85 17.46,34.93 17.46,40.01 17.46,45.09 11.11,45.09 11.11,40.01 11.11,34.93 11.11,29.85 11.75,25.4 1.59,116.84 1.59,111.76 1.59,106.68 1.59,101.6 1.59,96.52 1.59,91.44 1.59,86.36 1.59,81.28 1.59,76.2 1.59,71.12 1.59,66.04 1.59,60.96 1.59,55.88 1.59,50.8 1.59,45.72 1.59,40.64 1.59,35.56 1.59,30.48 1.59,25.4 1.59,20.32 1.59,15.24 1.59,11.43 6.67,11.43 11.75,11.43 12.38,17.78 16.19,16.51 11.75,20.32 104.46,101.6 33.97,24.13 33.97,31.75 45.4,31.75 45.4,24.13 27.62,33.02 38.42,47.62 40.96,47.62 39.69,41.91 39.69,36.83 39.69,31.75 39.69,26.67 30.16,38.74 32.07,41.28 26.99,41.91 28.89,43.82 47.31,41.28 49.21,38.74 50.48,43.82 52.39,41.91 35.24,48.9 44.13,48.9 39.69,51.44 46.04,53.34 33.34,53.34 50.48,67.31 26.35,65.41 28.89,65.41 28.89,60.33 26.35,60.33 26.35,55.25 28.89,55.25 28.89,50.17 26.35,50.17 26.35,45.09 53.02,65.41 53.02,60.33 53.02,55.25 53.02,50.17 53.02,45.09 50.48,50.17 50.48,55.25 50.48,60.33 48.58,73.03 46.04,71.12 51.75,69.85 51.75,74.93 49.85,76.84 39.69,73.03 53.02,29.85 50.48,29.85 50.48,24.77 53.02,24.77 61.91,24.77 61.91,29.85 64.45,24.77 61.91,50.17 64.45,50.17 61.91,45.09 64.45,45.09 61.91,34.93 64.45,34.93 61.91,40.01 61.91,55.25 64.45,55.25 64.45,60.33 61.91,60.33 64.45,65.41 61.91,65.41 63.82,70.48 65.72,68.58 67.63,73.66 69.53,71.76 72.07,75.56 72.07,73.03 79.06,75.56 79.06,78.11 82.87,78.11 82.87,75.56 79.69,73.03 75.88,75.56 75.88,73.03 86.04,65.41 88.58,65.41 86.04,60.33 88.58,60.33 88.58,55.25 86.04,55.25 86.04,50.17 88.58,50.17 88.58,45.09 86.04,45.09 86.04,40.01 88.58,40.01 88.58,27.31 88.58,32.39 88.58,34.93 97.47,29.85 100.65,29.85 103.82,29.85 103.82,24.77 100.65,24.77 97.47,24.77 97.47,40.01 100.65,40.01 103.82,40.01 103.82,34.93 100.65,34.93 97.47,34.93 97.47,45.09 100.65,45.09 103.82,45.09 100.65,50.17 97.47,50.17 103.82,50.17 103.82,55.25 100.65,55.25 97.47,55.25 97.47,60.33 100.65,60.33 103.82,60.33 103.82,65.41 100.65,65.41 97.47,65.41 100.65,69.22 98.11,71.12 103.82,67.95 101.92,74.93 104.46,72.39 111.44,75.56 72.71,81.28 108.27,81.28 107,70.48 108.27,76.2 134.94,116.84 134.94,111.76 134.94,106.68 134.94,101.6 134.94,96.52 134.94,91.44 134.94,86.36 134.94,81.28 134.94,76.2 134.94,71.12 134.94,66.04 134.94,60.96 134.94,55.88 134.94,50.8 134.94,45.72 134.94,40.64 134.94,35.56 134.94,30.48 134.94,25.4 134.94,20.32 134.94,15.24 134.94,11.43 114.62,11.43 119.7,11.43 124.78,11.43 129.86,11.43 109.54,11.43 104.46,11.43 118.43,52.07 123.51,52.07 118.43,20.32 123.51,20.32 118.43,96.52 123.51,96.52 118.43,64.77 123.51,64.77 109.54,109.86 39.69,59.06 28.26,12.07 40.96,12.7 13.65,13.34 70.17,20.32 86.04,70.48 88.58,70.48 88.58,75.56 86.04,75.56 86.68,78.11 111.44,79.38 6.67,100.33 68.26,22.23 74.61,53.98 74.61,47.62 62.55,116.84 67.63,116.84 52.39,116.84 47.31,116.84 26.99,116.84 32.07,116.84 16.83,116.84 11.75,116.84 98.11,116.84 103.19,116.84 87.95,116.84 82.87,116.84 109.54,116.84 114.62,116.84 119.7,116.84 124.78,116.84 129.86,116.84 6.67,116.84 39.69,116.84 75.25,116.84
  pour Top (rank 4): 0.32,0 137.48,0 137.48,128.27 0.32,128.27
  pour Bottom (isolate 0.254, rank 5): 137.48,117.48 0.32,117.48 0.32,10.8 137.48,10.8
  pour Bottom: 70.8,60.96 arc90 69.53,59.69 arc90 70.8,58.42 arc90 72.07,59.69 arc90
  pour Bottom: 66.99,48.26 arc90 65.72,46.99 arc90 66.99,45.72 arc90 68.26,46.99 arc90
  pour Bottom: 83.5,50.17 arc90 82.23,48.9 arc90 83.5,47.62 arc90 84.77,48.9 arc90
  pour Bottom: 78.42,60.33 arc90 77.15,59.06 arc90 78.42,57.79 arc90 79.69,59.06 arc90
N$2
  Bottom 0.406: IC4.2 IC4.1 77.86,43.13 R35.1
N$3
  Bottom 0.406: R19.1 8.57,97.03 R26.1 C2.1 8.44,102.37 X1.SIGNAL
N$4
  Bottom 0.406: IC7.2 80.96,90.17 80.33,90.81 80.33,92.08 79.82,92.08 R48.2 C37.1
N$5
  Bottom 0.406: IC3.6 11.11,81.28 11.75,80.65 15.56,80.65 16.19,81.28 16.19,96.52 18.1,98.43 20.64,98.43 R1.R2B
N$6
  Bottom 0.406: IC2.5 72.63,23.7 R33.2
N$7  (via drill 0.6)
  Top 0.406: v79.06,13.34 v79.06,10.8
  Bottom 0.406: 18.1,14.61 17.46,13.97 14.92,13.97 14.29,14.61 R13.2 | R1.R2W 18.1,14.61 | 18.1,14.61 21.91,10.8 v79.06,10.8 | R4.1 v79.06,13.34
N$8  (1 unrouted)
  Bottom 0.406: R47.1 82.23,97.03 R50.2 C40.2 84.77,99.7 84.77,108.59 | 82.1,105.92 84.77,108.59 | 84.77,108.59 X12.RING
  Bottom 0.813: R51.1 82.1,105.92
N$10
  Bottom 0.406: R1.R1W 23.18,13.97 23.81,13.34 27.62,13.34 28.89,14.61 | 28.89,14.61 R15.2 | 28.89,14.61 29.53,13.97 46.67,13.97 48.58,12.07 70.17,12.07 70.8,12.7 70.8,15.24 R9.1
N$11
  Bottom 0.406: IC2.7 71.44,27.94 70.17,29.21 69.66,29.21 C19.2 R21.2 R11.1 67.12,31.75 67.63,31.75 72,36.12 IC4.5
N$12
  Bottom 0.406: IC3.1 7.41,88.34 R27.2
N$13
  Bottom 0.406: C3.1 R6.2 33.47,92.08 33.97,92.08 33.97,90.81 34.61,90.17 IC1.2
N$14
  Bottom 0.406: IC5.2 45.4,90.17 44.77,90.81 44.77,92.08 44.26,92.08 R38.2 C25.1
N$16
  Bottom 0.406: R5.1 35.88,97.03 R8.2 C23.2 38.29,99.7 C6.1 38.55,99.83 39.05,100.33 39.05,105.41 38.55,105.92 R14.1 | 32.83,105.92 X6.RING
  Bottom 0.813: R14.1 32.83,105.92
N$17
  Bottom 0.406: IC3.3 R16.2 C14.2
N$18
  Bottom 0.406: IC3.2 9.84,90.17 9.21,90.81 9.21,91.31 R19.2 C5.1
N$19
  Bottom 0.406: R16.1 11.11,97.03 R26.2 C2.2 11.37,99.83 C13.1 X1.RING | X1.RING 8.44,109.22 | 10.35,105.92 X1.RING
  Bottom 0.813: R3.1 10.35,105.92
N$20
  Bottom 0.406: IC2.3 80.46,26.67 R34.2
N$21
  Bottom 0.406: R17.2 R4.2 R22.2 82.1,19.05 82.23,19.05 82.23,19.69 82.87,20.32 83.5,20.32 85.09,21.91 85.09,25.72 84.64,26.17 C18.2 83.37,28.32 R28.1 C1.1 80.46,27.94 IC2.2
N$23
  Bottom 0.406: R23.2 R9.2 R18.2 67.76,18.68 67.76,19.82 69.66,21.72 C17.2 69.66,26.41 C19.1 | R21.1 C19.1 | IC2.6 69.66,26.67 C19.1
N$24
  Bottom 0.406: R6.1 33.34,97.03 R8.1 C23.1 36.38,102.87 X6.SIGNAL
N$25
  Bottom 0.406: IC1.8 32.65,83.11 R7.1
N$26
  Bottom 0.406: IC3.8 7.72,83.11 R27.1
N$27
  Bottom 0.406: C22.2 R5.2 IC1.3
N$28
  Bottom 0.406: IC1.6 35.88,78.74 35.24,78.11 30.16,78.11 27.62,80.65 27.62,97.79 26.99,98.43 25.72,98.43 R1.R1B
N$29
  Bottom 0.406: R2.R2W 89.22,14.61 88.58,13.97 84.77,13.97 84.14,14.61 R29.2 R22.1
N$30
  Bottom 0.406: R30.2 100.01,14.61 98.74,13.34 95.57,13.34 94.3,14.61 | 94.3,14.61 R2.R1W | 94.3,14.61 91.76,12.07 72.71,12.07 72.07,12.7 72.07,15.24 72.58,15.75 R23.1
N$31
  Bottom 0.406: IC1.1 32.65,88.34 R7.2
N$32
  Bottom 0.406: C53.1 40.94,53.34
  Bottom 0.813: U$1.P$1 40.94,53.34 40.94,50.65 B1.AC1
N$33
  Bottom 0.813: B1.+ 40.96,42.42 R24.1
N$34
  Bottom 0.406: C54.2 38.44,53.34
  Bottom 0.813: U$1.P$3 38.44,53.34 38.44,50.65 B1.AC2
N$35
  Bottom 0.813: B1.- 38.42,42.42 R25.1
N$36
  Bottom 0.406: R36.1 69.53,43.05 69.53,40.01 70.8,38.74 IC4.7 IC4.6
N$38  (via drill 0.6)
  Top 0.406: LED1.A 40.17,6.51 39.05,7.62 v39.05,15.24
  Bottom 0.406: v39.05,15.24 39.69,15.24 40.19,15.75 R20.1
N$39
  Bottom 0.406: R48.1 79.69,97.03 R50.1 C40.1 79.56,102.37 X12.SIGNAL
N$40
  Bottom 0.406: IC2.1 79.9,31.25 C1.2 R28.2 R12.1 83.37,33.66 82.87,33.66 80.33,36.83 79.69,37.47 IC4.3
N$41
  Bottom 0.406: R37.1 46.67,97.03 R40.2 C28.2 49.08,99.7 C26.1 X9.RING | 48.07,111 X9.RING | 46.54,105.92 X9.RING
  Bottom 0.813: R41.1 46.54,105.92
N$42
  Bottom 0.406: R38.1 44.13,97.03 R40.1 C28.1 44,102.37 X9.SIGNAL
N$43
  Bottom 0.406: IC5.8 43.44,83.11 R39.1
N$44
  Bottom 0.406: IC5.3 R37.2 48.45,91.95 48.58,92.08 49.08,92.08 C27.2
N$45
  Bottom 0.406: IC6.6 71.44,78.74 70.8,78.11 65.72,78.11 63.18,80.65 63.18,97.79 62.55,98.43 61.28,98.43 R10.R1B
N$46
  Bottom 0.406: IC5.1 43.44,88.34 R39.2
N$47
  Bottom 0.406: IC6.2 70.17,90.17 69.53,90.81 69.53,91.31 R43.2 C29.1
N$48
  Bottom 0.406: R42.1 71.44,97.03 R45.2 C32.2 73.98,99.7 C30.1 74.11,99.83 74.61,100.33 74.61,105.41 74.11,105.92 R46.1 | 68.39,105.92 X10.RING
  Bottom 0.813: R46.1 68.39,105.92
N$49
  Bottom 0.406: R43.1 68.9,97.03 R45.1 C32.1 71.94,102.87 X10.SIGNAL
N$50
  Bottom 0.406: IC6.8 68.21,83.11 R44.1
N$51
  Bottom 0.406: IC6.3 R42.2 C31.2
N$52
  Bottom 0.406: IC5.6 46.67,81.28 47.31,80.65 51.12,80.65 51.75,81.28 51.75,96.52 53.66,98.43 56.2,98.43 R10.R2B
N$53
  Bottom 0.406: IC6.1 68.21,88.34 R44.2
N$54  (via drill 0.6)
  Top 0.406: v69.53,13.34 v73.34,13.34
  Bottom 0.406: R10.R2W 53.66,14.61 | 53.66,14.61 54.93,13.34 v69.53,13.34 | R31.2 49.85,14.61 50.48,13.97 53.02,13.97 53.66,14.61 | R17.1 75.88,15.24 75.88,13.97 75.25,13.34 v73.34,13.34
N$55
  Bottom 0.406: R10.R1W 58.74,15.24 59.37,14.61 63.95,14.61 R32.2 R18.1
N$57
  Bottom 0.406: IC7.8 79,83.11 R49.1
N$58
  Bottom 0.406: IC7.3 R47.2 C39.2
N$59
  Bottom 0.406: IC7.1 79,88.34 R49.2
N$60
  Bottom 0.406: IC8.2 105.73,90.17 105.09,90.81 105.09,92.08 104.59,92.08 R53.2 C41.1
N$61
  Bottom 0.406: R52.1 107,97.03 R55.2 C44.2 109.41,99.7 C42.1 109.54,99.7 110.17,100.33 110.17,105.41 109.67,105.92 R56.1 | 103.95,105.92 X11.RING
  Bottom 0.813: R56.1 103.95,105.92
N$62
  Bottom 0.406: R53.1 104.46,97.03 R55.1 C44.1 107.5,102.87 X11.SIGNAL
N$63
  Bottom 0.406: IC8.8 103.77,83.11 R54.1
N$64
  Bottom 0.406: IC8.3 R52.2 C43.2
N$65
  Bottom 0.406: IC8.1 103.77,88.34 R54.2
N$66
  Bottom 0.406: IC8.6 107,78.74 106.36,78.11 101.28,78.11 98.74,80.65 98.74,97.79 98.11,98.43 96.84,98.43 R2.R1B
N$67
  Bottom 0.406: IC7.6 82.23,81.28 82.87,80.65 86.68,80.65 87.31,81.28 87.31,95.89 87.95,96.52 89.85,96.52 91.76,98.43 R2.R2B
N$69
  Bottom 0.406: C55.1 R36.2
N$70
  Bottom 0.406: C56.1 R35.2
N$71
  Bottom 0.406: C57.1 R12.2
N$72
  Bottom 0.406: R11.2 C58.1
N$73  (1 unrouted)
  Bottom 0.406: C57.2 83.5,45.09
  pour Bottom: 83.5,46.36 arc-90 84.77,45.09 arc-90 83.5,43.82 arc-90 82.23,45.09 arc-90
N$74  (1 unrouted)
  Bottom 0.406: C58.2 66.99,43.18
  pour Bottom: 66.99,44.45 arc-90 68.26,43.18 arc-90 66.99,41.91 arc-90 65.72,43.18 arc-90
N$75  (1 unrouted)
  Bottom 0.406: C56.2 78.42,55.25
  pour Bottom: 78.42,56.52 arc-90 79.69,55.25 arc-90 78.42,53.98 arc-90 77.15,55.25 arc-90
N$76  (1 unrouted)
  Bottom 0.406: C55.2 70.8,55.88
  pour Bottom: 70.8,57.15 arc-90 72.07,55.88 arc-90 70.8,54.61 arc-90 69.53,55.88 arc-90

### Text on the board
Reference: mounting hole vertical dist = 122.5 mm = 4.82" / PCB total height = 128.7 mm = 5.06" | mounting hole pitch = 0.2"
tDocu: CH | 1 | CH | 2 | CH | 3 | MON | OUT | STEREO MIXER
bDocu: POWER IN | GND | -15V | +15V